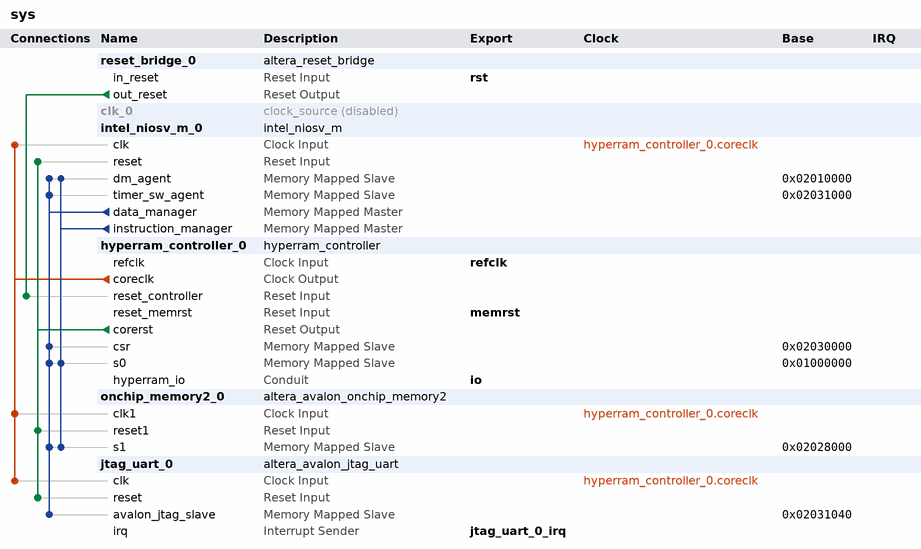
[diagram p0: system contents]
# Platform Designer (Qsys) system sys, Cyclone 10 LP 10CL025YU256I7G
# Parameters at their usual value, and those the tool derives, are not listed.
package require -exact qsys 24.1
create_system sys
set_project_property DEVICE_FAMILY {Cyclone 10 LP}
set_project_property DEVICE 10CL025YU256I7G

add_instance reset_bridge_0 altera_reset_bridge 24.1
set_instance_parameter_value reset_bridge_0 ACTIVE_LOW_RESET 0
set_instance_parameter_value reset_bridge_0 SYNCHRONOUS_EDGES none

add_instance clk_0 clock_source 24.1
set_instance_property clk_0 ENABLED false
set_instance_parameter_value clk_0 clockFrequency 50000000

add_instance intel_niosv_m_0 intel_niosv_m 26.0.0
set_instance_parameter_value intel_niosv_m_0 clockFrequency 0
set_instance_parameter_value intel_niosv_m_0 enableAvalonInterface true
set_instance_parameter_value intel_niosv_m_0 enableDebugReset false
set_instance_parameter_value intel_niosv_m_0 enableECCLite false
set_instance_parameter_value intel_niosv_m_0 hartId 0
set_instance_parameter_value intel_niosv_m_0 interruptMode 0
set_instance_parameter_value intel_niosv_m_0 pipelineArch false
set_instance_parameter_value intel_niosv_m_0 resetSlave hyperram_controller_0.s0

add_instance hyperram_controller_0 hyperram_controller 0.3

add_instance onchip_memory2_0 altera_avalon_onchip_memory2 24.1
set_instance_parameter_value onchip_memory2_0 dataWidth 32
set_instance_parameter_value onchip_memory2_0 dualPort false
set_instance_parameter_value onchip_memory2_0 initMemContent true
set_instance_parameter_value onchip_memory2_0 initializationFileName onchip_mem.hex
set_instance_parameter_value onchip_memory2_0 memorySize 32768

add_instance jtag_uart_0 altera_avalon_jtag_uart 24.1
set_instance_parameter_value jtag_uart_0 readIRQThreshold 0
set_instance_parameter_value jtag_uart_0 simInteractiveOptions NO_INTERACTIVE_WINDOWS
set_instance_parameter_value jtag_uart_0 writeIRQThreshold 0

# connections
add_connection hyperram_controller_0.coreclk intel_niosv_m_0.clk clock
add_connection hyperram_controller_0.coreclk jtag_uart_0.clk clock
add_connection hyperram_controller_0.coreclk onchip_memory2_0.clk1 clock
add_connection hyperram_controller_0.corerst intel_niosv_m_0.reset reset
add_connection hyperram_controller_0.corerst jtag_uart_0.reset reset
add_connection hyperram_controller_0.corerst onchip_memory2_0.reset1 reset
add_connection reset_bridge_0.out_reset hyperram_controller_0.reset_controller reset
add_connection intel_niosv_m_0.data_manager hyperram_controller_0.csr avalon
set_connection_parameter_value intel_niosv_m_0.data_manager/hyperram_controller_0.csr baseAddress 0x02030000
add_connection intel_niosv_m_0.data_manager hyperram_controller_0.s0 avalon
set_connection_parameter_value intel_niosv_m_0.data_manager/hyperram_controller_0.s0 baseAddress 0x01000000
add_connection intel_niosv_m_0.data_manager intel_niosv_m_0.dm_agent avalon
set_connection_parameter_value intel_niosv_m_0.data_manager/intel_niosv_m_0.dm_agent baseAddress 0x02010000
add_connection intel_niosv_m_0.data_manager intel_niosv_m_0.timer_sw_agent avalon
set_connection_parameter_value intel_niosv_m_0.data_manager/intel_niosv_m_0.timer_sw_agent baseAddress 0x02031000
add_connection intel_niosv_m_0.data_manager jtag_uart_0.avalon_jtag_slave avalon
set_connection_parameter_value intel_niosv_m_0.data_manager/jtag_uart_0.avalon_jtag_slave baseAddress 0x02031040
add_connection intel_niosv_m_0.data_manager onchip_memory2_0.s1 avalon
set_connection_parameter_value intel_niosv_m_0.data_manager/onchip_memory2_0.s1 baseAddress 0x02028000
add_connection intel_niosv_m_0.instruction_manager hyperram_controller_0.s0 avalon
set_connection_parameter_value intel_niosv_m_0.instruction_manager/hyperram_controller_0.s0 baseAddress 0x01000000
add_connection intel_niosv_m_0.instruction_manager intel_niosv_m_0.dm_agent avalon
set_connection_parameter_value intel_niosv_m_0.instruction_manager/intel_niosv_m_0.dm_agent baseAddress 0x02010000
add_connection intel_niosv_m_0.instruction_manager onchip_memory2_0.s1 avalon
set_connection_parameter_value intel_niosv_m_0.instruction_manager/onchip_memory2_0.s1 baseAddress 0x02028000

# exported interfaces
add_interface io conduit end
set_interface_property io EXPORT_OF hyperram_controller_0.hyperram_io
add_interface jtag_uart_0_irq interrupt sender
set_interface_property jtag_uart_0_irq EXPORT_OF jtag_uart_0.irq
add_interface memrst reset sink
set_interface_property memrst EXPORT_OF hyperram_controller_0.reset_memrst
add_interface refclk clock sink
set_interface_property refclk EXPORT_OF hyperram_controller_0.refclk
add_interface rst reset sink
set_interface_property rst EXPORT_OF reset_bridge_0.in_reset

set_interconnect_requirement {$system} qsys_mm.clockCrossingAdapter HANDSHAKE
set_interconnect_requirement {$system} qsys_mm.enableEccProtection FALSE
set_interconnect_requirement {$system} qsys_mm.insertDefaultSlave FALSE
set_interconnect_requirement {$system} qsys_mm.maxAdditionalLatency 1

save_system sys.qsys
